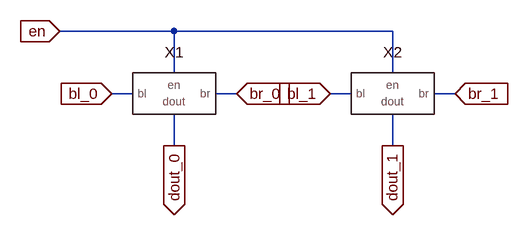
[diagram p0: schematic sram_16x2_sense_amp_array.asc]
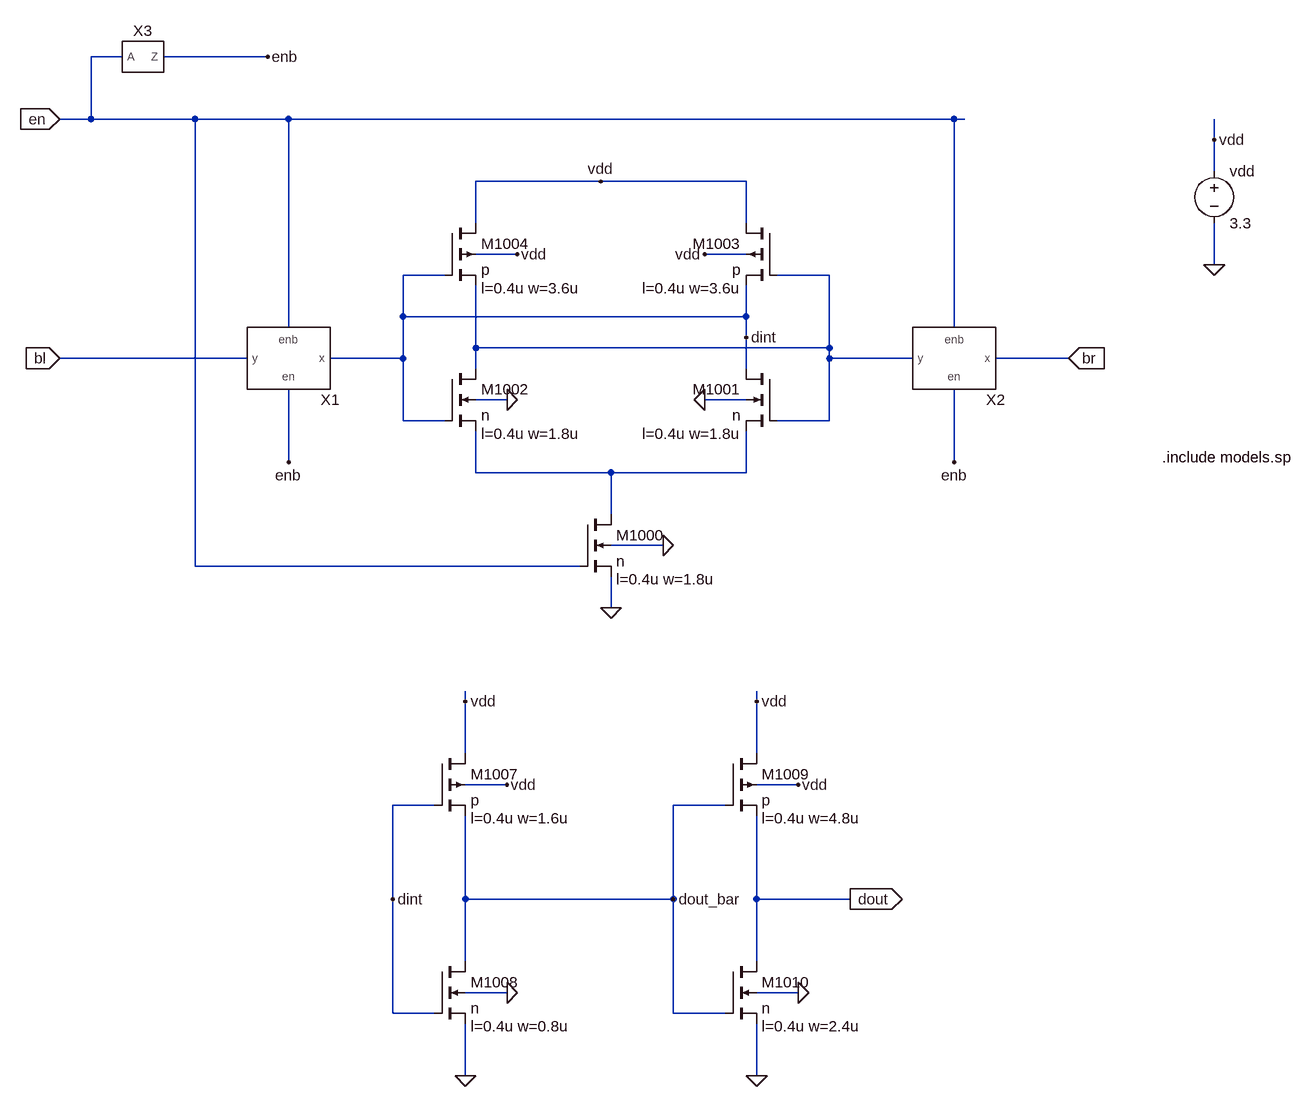
[diagram p1: sub-circuit sense_amp.asc]
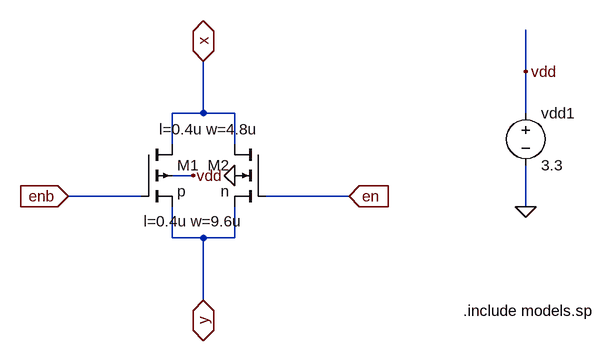
[diagram p2: sub-circuit tri_gate.asc]
sram_16x2_sense_amp_array.asc, the LTspice schematic file:
Version 4
SHEET 1 880 680
WIRE 176 32 0 32
WIRE 512 32 176 32
WIRE 176 96 176 32
WIRE 512 96 512 32
WIRE 112 128 80 128
WIRE 272 128 240 128
WIRE 448 128 416 128
WIRE 608 128 576 128
WIRE 176 208 176 160
WIRE 512 208 512 160
FLAG 0 32 en
IOPIN 0 32 In
FLAG 80 128 bl_0
IOPIN 80 128 In
FLAG 416 128 bl_1
IOPIN 416 128 In
FLAG 272 128 br_0
IOPIN 272 128 In
FLAG 608 128 br_1
IOPIN 608 128 In
FLAG 176 208 dout_0
IOPIN 176 208 Out
FLAG 512 208 dout_1
IOPIN 512 208 Out
SYMBOL sense_amp 176 144 R0
SYMATTR InstName X1
SYMBOL sense_amp 512 144 R0
SYMATTR InstName X2

sense_amp.asc, the sub-circuit schematic file:
Version 4
SHEET 1 2104 2356
WIRE -2240 768 -2288 768
WIRE -2016 768 -2176 768
WIRE -2288 864 -2288 768
WIRE -2288 864 -2336 864
WIRE -2128 864 -2288 864
WIRE -1984 864 -2128 864
WIRE -960 864 -1984 864
WIRE -944 864 -960 864
WIRE -560 896 -560 864
WIRE -560 944 -560 896
WIRE -1504 960 -1696 960
WIRE -1280 960 -1504 960
WIRE -1696 1024 -1696 960
WIRE -1280 1024 -1280 960
WIRE -1632 1072 -1696 1072
WIRE -1280 1072 -1344 1072
WIRE -560 1088 -560 1024
WIRE -1744 1104 -1808 1104
WIRE -1152 1104 -1232 1104
WIRE -1808 1168 -1808 1104
WIRE -1280 1168 -1280 1120
WIRE -1280 1168 -1808 1168
WIRE -1984 1184 -1984 864
WIRE -960 1184 -960 864
WIRE -1280 1200 -1280 1168
WIRE -1696 1216 -1696 1120
WIRE -1152 1216 -1152 1104
WIRE -1152 1216 -1696 1216
WIRE -2048 1232 -2336 1232
WIRE -1808 1232 -1808 1168
WIRE -1808 1232 -1920 1232
WIRE -1152 1232 -1152 1216
WIRE -1024 1232 -1152 1232
WIRE -784 1232 -896 1232
WIRE -1696 1248 -1696 1216
WIRE -1280 1248 -1280 1200
WIRE -1648 1296 -1696 1296
WIRE -1280 1296 -1344 1296
WIRE -1808 1328 -1808 1232
WIRE -1744 1328 -1808 1328
WIRE -1152 1328 -1152 1232
WIRE -1152 1328 -1232 1328
WIRE -1984 1392 -1984 1280
WIRE -960 1392 -960 1280
WIRE -1696 1408 -1696 1344
WIRE -1488 1408 -1696 1408
WIRE -1280 1408 -1280 1344
WIRE -1280 1408 -1488 1408
WIRE -1488 1472 -1488 1408
WIRE -1408 1520 -1488 1520
WIRE -2128 1552 -2128 864
WIRE -1536 1552 -2128 1552
WIRE -1488 1616 -1488 1568
WIRE -1712 1760 -1712 1744
WIRE -1264 1760 -1264 1744
WIRE -1712 1840 -1712 1760
WIRE -1264 1840 -1264 1760
WIRE -1648 1888 -1712 1888
WIRE -1200 1888 -1264 1888
WIRE -1760 1920 -1824 1920
WIRE -1312 1920 -1392 1920
WIRE -1824 2064 -1824 1920
WIRE -1712 2064 -1712 1936
WIRE -1392 2064 -1392 1920
WIRE -1392 2064 -1712 2064
WIRE -1264 2064 -1264 1936
WIRE -1120 2064 -1264 2064
WIRE -1712 2160 -1712 2064
WIRE -1264 2160 -1264 2064
WIRE -1648 2208 -1712 2208
WIRE -1200 2208 -1264 2208
WIRE -1824 2240 -1824 2064
WIRE -1760 2240 -1824 2240
WIRE -1392 2240 -1392 2064
WIRE -1312 2240 -1392 2240
WIRE -1712 2336 -1712 2256
WIRE -1264 2336 -1264 2256
FLAG -1712 2336 0
FLAG -560 1088 0
FLAG -560 896 vdd
FLAG -1264 1760 vdd
FLAG -1712 1760 vdd
FLAG -1824 2064 dint
FLAG -1392 2064 dout_bar
FLAG -1264 2336 0
FLAG -1120 2064 dout
IOPIN -1120 2064 Out
FLAG -1488 1616 0
FLAG -1280 1200 dint
FLAG -1504 960 vdd
FLAG -1648 2208 0
FLAG -1200 2208 0
FLAG -1344 1296 0
FLAG -1648 1296 0
FLAG -1408 1520 0
FLAG -1632 1072 vdd
FLAG -1344 1072 vdd
FLAG -1200 1888 vdd
FLAG -1648 1888 vdd
FLAG -2336 864 en
IOPIN -2336 864 In
FLAG -2336 1232 bl
IOPIN -2336 1232 In
FLAG -784 1232 br
IOPIN -784 1232 In
FLAG -2016 768 enb
FLAG -960 1392 enb
FLAG -1984 1392 enb
SYMBOL nmos4 -1536 1472 R0
WINDOW 123 56 100 Left 2
SYMATTR Value2 l=0.4u w=1.8u
SYMATTR InstName M1000
SYMATTR Value n
SYMBOL nmos4 -1232 1248 M0
WINDOW 123 56 100 Left 2
SYMATTR Value2 l=0.4u w=1.8u
SYMATTR InstName M1001
SYMATTR Value n
SYMBOL nmos4 -1744 1248 R0
WINDOW 123 56 100 Left 2
SYMATTR Value2 l=0.4u w=1.8u
SYMATTR InstName M1002
SYMATTR Value n
SYMBOL nmos4 -1760 2160 R0
WINDOW 123 56 100 Left 2
SYMATTR Value2 l=0.4u w=0.8u
SYMATTR InstName M1008
SYMATTR Value n
SYMBOL nmos4 -1312 2160 R0
WINDOW 123 56 100 Left 2
SYMATTR Value2 l=0.4u w=2.4u
SYMATTR InstName M1010
SYMATTR Value n
SYMBOL pmos4 -1232 1024 M0
WINDOW 123 56 100 Left 2
SYMATTR Value2 l=0.4u w=3.6u
SYMATTR InstName M1003
SYMATTR Value p
SYMBOL pmos4 -1744 1024 R0
WINDOW 123 56 100 Left 2
SYMATTR Value2 l=0.4u w=3.6u
SYMATTR InstName M1004
SYMATTR Value p
SYMBOL pmos4 -1312 1840 R0
WINDOW 123 56 100 Left 2
SYMATTR Value2 l=0.4u w=4.8u
SYMATTR InstName M1009
SYMATTR Value p
SYMBOL pmos4 -1760 1840 R0
WINDOW 123 56 100 Left 2
SYMATTR Value2 l=0.4u w=1.6u
SYMATTR InstName M1007
SYMATTR Value p
SYMBOL voltage -560 928 R0
SYMATTR InstName vdd
SYMATTR Value 3.3
SYMBOL tri_gate -1984 1232 R180
SYMATTR InstName X1
SYMBOL tri_gate -960 1232 R180
SYMATTR InstName X2
SYMBOL inv -2208 768 R0
SYMATTR InstName X3
TEXT -640 1384 Left 2 !.include models.sp

tri_gate.asc, the sub-circuit schematic file:
Version 4
SHEET 1 880 680
WIRE 576 -16 576 -80
WIRE 80 48 80 -32
WIRE 80 48 32 48
WIRE 128 48 80 48
WIRE 576 48 576 -16
WIRE 32 96 32 48
WIRE 128 96 128 48
WIRE 64 144 32 144
WIRE -16 176 -128 176
WIRE 304 176 176 176
WIRE 576 192 576 128
WIRE 32 240 32 192
WIRE 80 240 32 240
WIRE 128 240 128 192
WIRE 128 240 80 240
WIRE 80 336 80 240
FLAG 128 144 0
FLAG 64 144 vdd
FLAG 576 192 0
FLAG 576 -16 vdd
FLAG 80 336 y
IOPIN 80 336 BiDir
FLAG 80 -32 x
IOPIN 80 -32 BiDir
FLAG 304 176 en
IOPIN 304 176 In
FLAG -128 176 enb
IOPIN -128 176 In
SYMBOL pmos4 -16 96 R0
WINDOW 123 4 118 Left 2
SYMATTR Value2 l=0.4u w=9.6u
SYMATTR InstName M1
SYMATTR Value p
SYMBOL nmos4 176 96 M0
WINDOW 123 12 -23 Left 2
SYMATTR Value2 l=0.4u w=4.8u
SYMATTR InstName M2
SYMATTR Value n
SYMBOL voltage 576 32 R0
WINDOW 123 0 0 Left 0
WINDOW 39 0 0 Left 0
SYMATTR InstName vdd1
SYMATTR Value 3.3
TEXT 480 352 Left 2 !.include models.sp

The netlist it stands for:
* sram_16x2_sense_amp_array.asc
XX1 bl_0 br_0 en dout_0 sense_amp
XX2 bl_1 br_1 en dout_1 sense_amp

* block symbol definitions
.subckt sense_amp bl br en dout
M1000 N002 en 0 0 n l=0.4u w=1.8u
M1001 dint N001 N002 0 n l=0.4u w=1.8u
M1002 N001 dint N002 0 n l=0.4u w=1.8u
M1008 dout_bar dint 0 0 n l=0.4u w=0.8u
M1010 dout dout_bar 0 0 n l=0.4u w=2.4u
M1003 vdd N001 dint vdd p l=0.4u w=3.6u
M1004 vdd dint N001 vdd p l=0.4u w=3.6u
M1009 vdd dout_bar dout vdd p l=0.4u w=4.8u
M1007 vdd dint dout_bar vdd p l=0.4u w=1.6u
vdd vdd 0 3.3
XX1 enb en dint bl tri_gate
XX2 enb en br N001 tri_gate
XX3 en enb inv  ; pins A Z
.include models.sp
.ends sense_amp

.subckt tri_gate en enb x y
M1 x enb y vdd p l=0.4u w=9.6u
M2 x en y 0 n l=0.4u w=4.8u
vdd1 vdd 0 3.3
.include models.sp
.ends tri_gate

.model NMOS NMOS
.model PMOS PMOS
.lib standard.mos
.backanno
.end